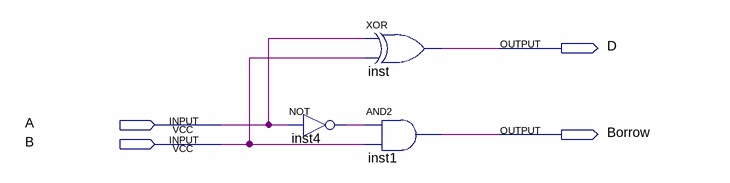
[diagram p0: schematic sheet]
// Quartus schematic Haft_Sub.bdf as structural Verilog: 3 symbols, 4 pins
module Haft_Sub (
  input  A,
  input  B,
  output D,
  output Borrow
);

  wire inst4_out;

  not inst4 (inst4_out, A);
  xor inst (D, A, B);
  and inst1 (Borrow, inst4_out, B);
endmodule
